# EAGLE schematic autism_ray_board (EAGLE 9.6.2)
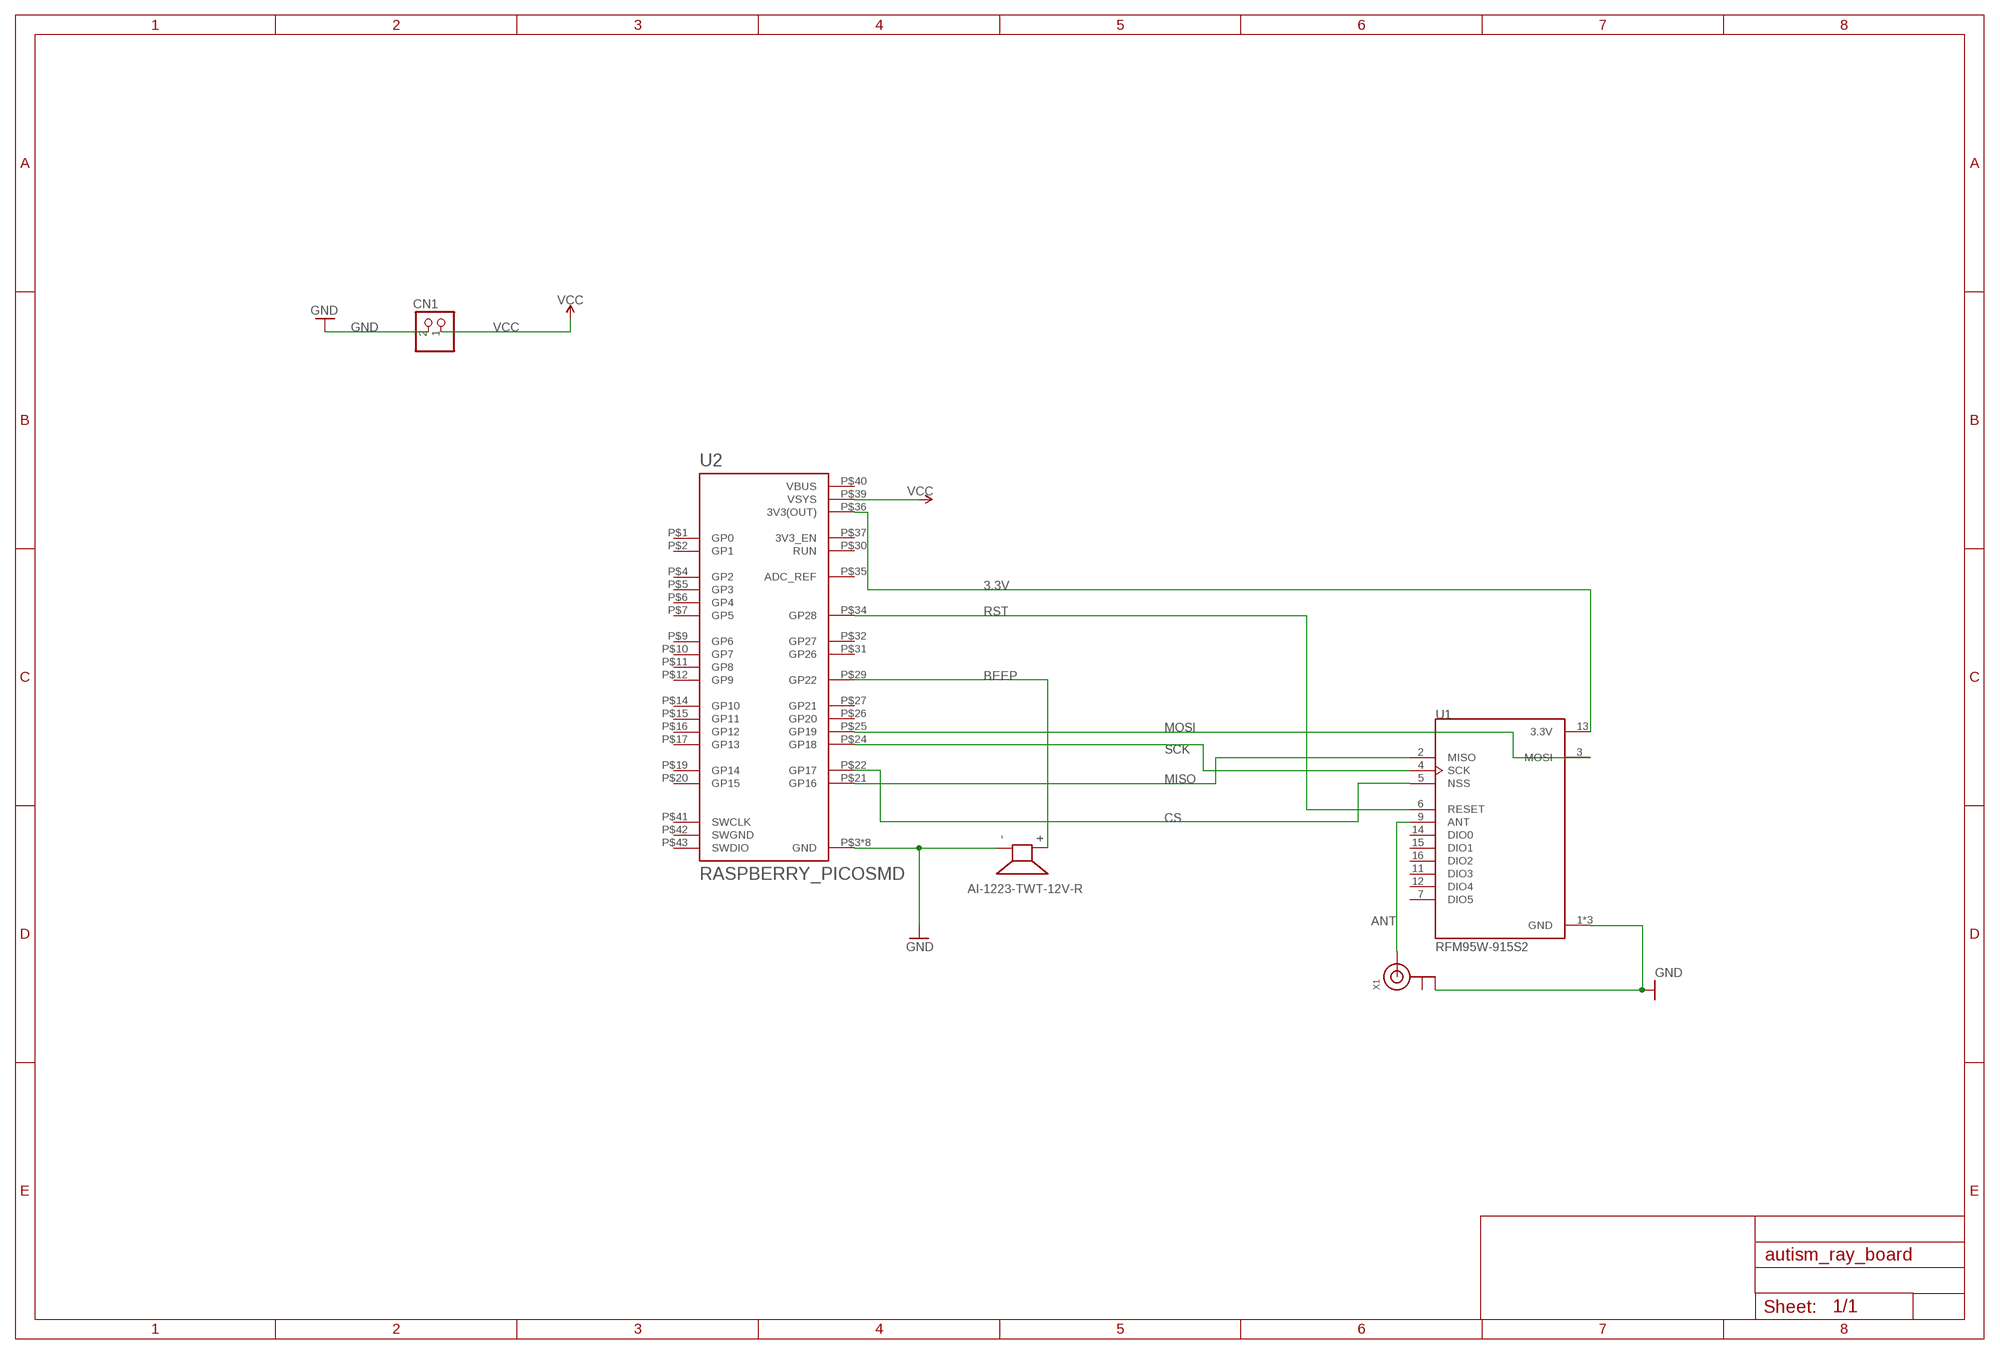
[diagram p0: schematic, sheet 1]

## Parts
CN1  JST_2PIN-SMT-RA  [JST-PH-2-SMT-RA]
LS1  AI-1223-TWT-12V-R  [XDCR_AI-1223-TWT-12V-R]
U1  RFM95W-915S2  [XCVR_RFM95W-915S2]
U2  RASPBERRY_PICOSMD  [PICO-PKG-SMD]
X1  ANTENNA_U.FL  [U.FL]

## Nets
3.3V: U1.13(3.3V) U2.P$36(3V3(OUT))
ANT: U1.9(ANT) X1.3(SIGNAL)
BEEP: LS1.P(+) U2.P$29(GP22)
CS: U1.5(NSS) U2.P$22(GP17)
GND: CN1.2 LS1.N(-) U1.1(GND) U1.8(GND) U1.10(GND) U2.P$3(GND) U2.P$8(GND) U2.P$13(GND) U2.P$18(GND) U2.P$23(GND) U2.P$28(GND) U2.P$33(GND) U2.P$38(GND) X1.2(GND)
MISO: U1.2(MISO) U2.P$21(GP16)
MOSI: U1.3(MOSI) U2.P$25(GP19)
RST: U1.6(RESET) U2.P$34(GP28)
SCK: U1.4(SCK) U2.P$24(GP18)
VCC: CN1.1 U2.P$39(VSYS)
Unconnected: U1.7(DIO5) U1.11(DIO3) U1.12(DIO4) U1.14(DIO0) U1.15(DIO1) U1.16(DIO2) U2.P$1(GP0) U2.P$2(GP1) U2.P$4(GP2) U2.P$5(GP3) U2.P$6(GP4) U2.P$7(GP5) U2.P$9(GP6) U2.P$10(GP7) U2.P$11(GP8) U2.P$12(GP9) U2.P$14(GP10) U2.P$15(GP11) U2.P$16(GP12) U2.P$17(GP13) U2.P$19(GP14) U2.P$20(GP15) U2.P$26(GP20) U2.P$27(GP21) U2.P$30(RUN) U2.P$31(GP26) U2.P$32(GP27) U2.P$35(ADC_REF) U2.P$37(3V3_EN) U2.P$41(SWCLK) U2.P$43(SWDIO) X1.1(GND)

## Power pins joined to a net without a drawn wire
SWGND: U2.P$42(SWGND)
VBUS: U2.P$40(VBUS)

## Library data of the parts
CN1 = adafruit:JST_2PIN: JST 2-Pin Connectors of various flavors SMT-RA (S2B-PH-SM4) 4UConnector #17311 SMT (B2B-PH-SM4) THM-RA (S2B-PH) THM (B2B-PH)
LS1 = buzzer:AI-1223-TWT-12V-R: Check availability <https://pricing.snapeda.com/parts/AI-1223-TWT-12V-R/PUI%20Audio%2C/view-part?ref=eda>; AVAILABILITY: In Stock; DESCRIPTION: ELECTRO-MECHANICAL AUDIO INDICATOR; MF: PUI Audio,; MP: AI-1223-TWT-12V-R; PACKAGE: None; PRICE: None; PURCHASE-URL: https://pricing.snapeda.com/search/part/AI-1223-TWT-12V-R/?ref=eda
U1 = RFM95W-915S2:RFM95W-915S2: RFM95(W) - Low Power Long Range Transceiver Module V1.0 Check availability <https://pricing.snapeda.com/parts/RFM95W-915S2/RF%20Solutions/view-part?ref=eda>; AVAILABILITY: In Stock; DESCRIPTION: 802.15.4 LoRa™ Transceiver Module 915MHz Antenna Not Included Surface Mount; MF: RF Solutions; MP: RFM95W-915S2; PACKAGE: Non Standard RF Solutions; PRICE: None; PURCHASE-URL: https://pricing.snapeda.com/search/part/RFM95W-915S2/?ref=eda
U2 = RpiPico:RASPBERRY_PICO: Raspberry Pi Pico
X1 = adafruit:ANTENNA_U.FL: U.FL Antenna Connector